# Altium schematic sheet STeaMi-FP8-Display_et_LED_statuts.SchDoc
size A3; DocumentNumber: 1; SheetNumber: 9; SheetTotal: 16
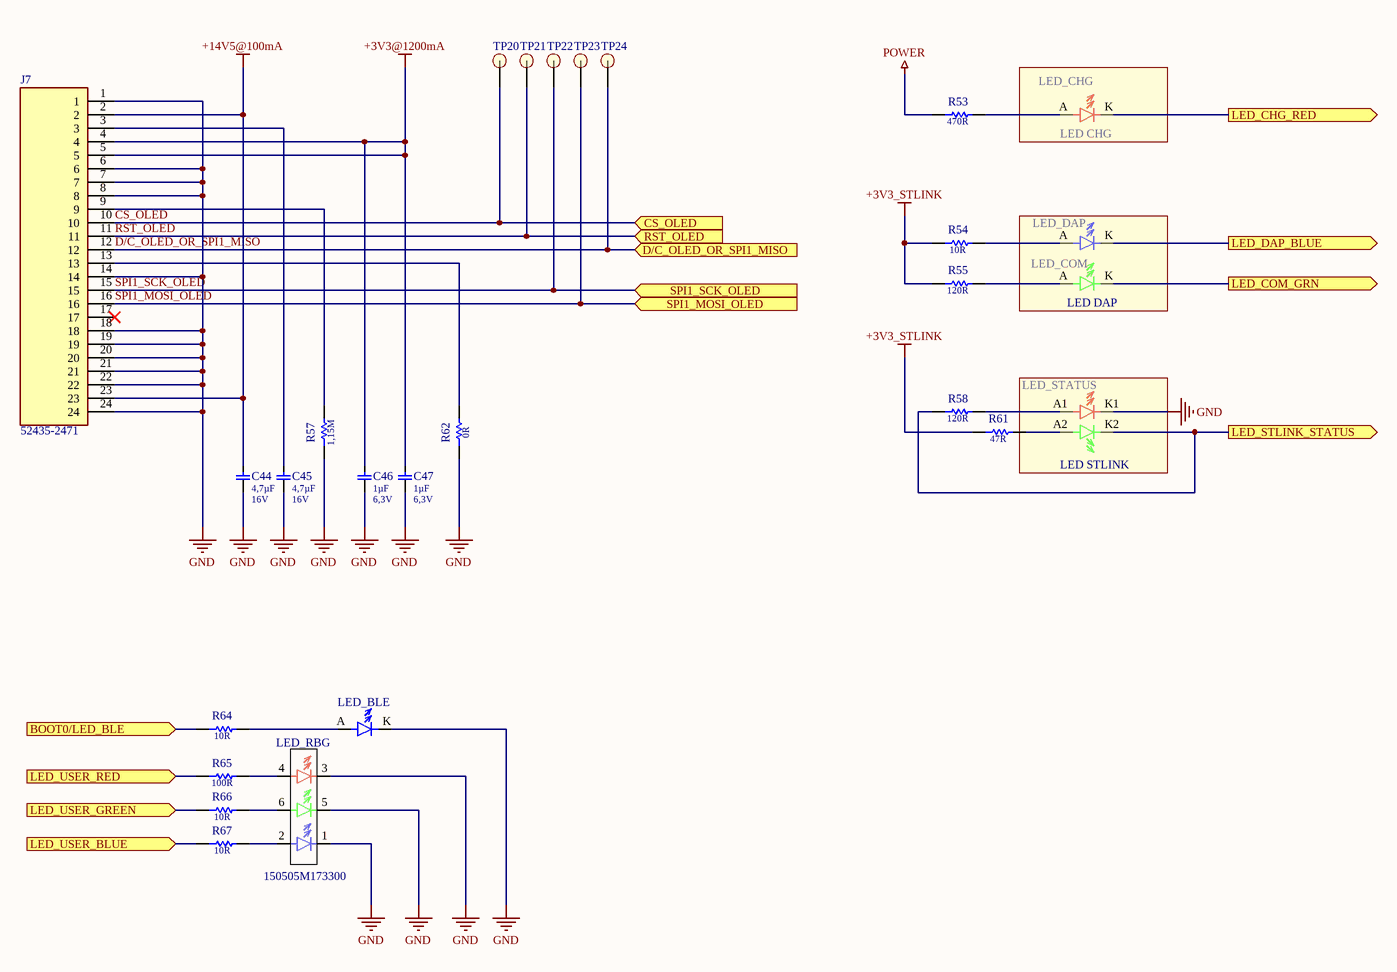
[diagram p0: STeaMi-FP8-Display_et_LED_statuts.SchDoc]

## Parts
C44  Capacitance: 4,7µF  Voltage: 16V  [0402-CAP]
C45  Capacitance: 4,7µF  Voltage: 16V  [0402-CAP]
C46  Capacitance: 1µF  Voltage: 6,3V  [0402-CAP]
C47  Capacitance: 1µF  Voltage: 6,3V  [0402-CAP]
J7  (no value)  [52435-2471]
LED_BLE  (no value)  [APTD1608LZGCK-B]
LED_CHG  (no value)  [APTD1608LZGCK]
LED_COM  (no value)  [APTD1608LZGCK]
LED_DAP  (no value)  [APTD1608LZGCK]
LED_RBG  (no value)  [150505M173300]
LED_STATUS  (no value)  [KPHBM2012QBDCGKC]
R53  Resistance: 470R  [RESC1005X40N_0402]
R54  Resistance: 10R  [RESC1005X40N_0402]
R55  Resistance: 120R  [RESC1005X40N_0402]
R57  Resistance: 1,15M  [RESC1005X40N_0402]
R58  Resistance: 120R  [RESC1005X40N_0402]
R61  Resistance: 47R  [RESC1005X40N_0402]
R62  Resistance: 0R  [RESC1005X40N_0402]
R64  Resistance: 10R  [RESC1005X40N_0402]
R65  Resistance: 100R  [RESC1005X40N_0402]
R66  Resistance: 10R  [RESC1005X40N_0402]
R67  Resistance: 10R  [RESC1005X40N_0402]
TP20  PAD  [Testpoint 1mm]  (value not drawn)  (no BOM)
TP21  PAD  [Testpoint 1mm]  (value not drawn)  (no BOM)
TP22  SCK1  [Testpoint 1mm]  (value not drawn)  (no BOM)
TP23  MOSI1  [Testpoint 1mm]  (value not drawn)  (no BOM)
TP24  PAD  [Testpoint 1mm]  (value not drawn)  (no BOM)

## Blocks framed on the sheet
LED CHG: LED_CHG
LED DAP: LED_COM LED_DAP
LED STLINK: LED_STATUS

## Ports
BOOT0/LED_BLE (in), CS_OLED (in), D/C_OLED_OR_SPI1_MISO (in), LED_CHG_RED (out), LED_COM_GRN (out), LED_DAP_BLUE (out), LED_STLINK_STATUS (out), LED_USER_BLUE (in), LED_USER_GREEN (in), LED_USER_RED (in), RST_OLED (in), SPI1_MOSI_OLED (in), SPI1_SCK_OLED (in)

## Nets
+3V3@1200mA: C46.2 C47.2 J7.4 J7.5
+3V3_STLINK: R54.1 R55.1 R61.1
+14V5@100mA: C44.2 J7.2 J7.23
GND: C44.1 C45.1 C46.1 C47.1 J7.1 J7.6 J7.7 J7.8 J7.14 J7.18 J7.19 J7.20 J7.21 J7.22 J7.24 LED_BLE.K LED_RBG.1 LED_RBG.3 LED_RBG.5 LED_STATUS.K1 R57.1 R62.1
POWER: R53.1
BOOT0/LED_BLE: R64.1 ; port BOOT0/LED_BLE
CS_OLED: J7.10 TP20.1 ; port CS_OLED
D/C_OLED_OR_SPI1_MISO: J7.12 TP24.1 ; port D/C_OLED_OR_SPI1_MISO
LED_CHG_RED: LED_CHG.K ; port LED_CHG_RED
LED_COM_GRN: LED_COM.K ; port LED_COM_GRN
LED_DAP_BLUE: LED_DAP.K ; port LED_DAP_BLUE
LED_STLINK_STATUS: LED_STATUS.K2 R58.1 ; port LED_STLINK_STATUS
LED_USER_BLUE: R67.1 ; port LED_USER_BLUE
LED_USER_GREEN: R66.1 ; port LED_USER_GREEN
LED_USER_RED: R65.1 ; port LED_USER_RED
RST_OLED: J7.11 TP21.1 ; port RST_OLED
SPI1_MOSI_OLED: J7.16 TP23.1 ; port SPI1_MOSI_OLED
SPI1_SCK_OLED: J7.15 TP22.1 ; port SPI1_SCK_OLED
NetC45_2: C45.2 J7.3
NetJ7_9: J7.9 R57.2
NetJ7_13: J7.13 R62.2
NetLED_BLE_A: LED_BLE.A R64.2
NetLED_CHG_A: LED_CHG.A R53.2
NetLED_COM_A: LED_COM.A R55.2
NetLED_DAP_A: LED_DAP.A R54.2
NetLED_RBG_2: LED_RBG.2 R67.2
NetLED_RBG_4: LED_RBG.4 R65.2
NetLED_RBG_6: LED_RBG.6 R66.2
NetLED_STATUS_A1: LED_STATUS.A1 R58.2
NetLED_STATUS_A2: LED_STATUS.A2 R61.2

Not connected (* = marked no-connect by the designer): J7 17*

## Notes on the sheet
- Le présent document est la propriété exclusive de SmartEmbed. Remis à titre confidentiel, il ne peut être communiqué
- IND
- DATE
- DESCRIPTION
- VISA
- à des tiers, ni utilisé ou reproduit qu'en stricte conformité d'autorisations expresses préalables.
- Etabli le:
- Verifié le:
- Validé le:
- Par:
- Page:
- /
- Pépinière CleanTech Domaine du Petit Arbois Avenue Louis Philibert BP 80058 13792 AIX-EN-PROVENCE CEDEX 3
- REFERENCE
- DESIGNATION

## Library data of the parts
C44 C45 = 4,7µF-20%-16V-X5R-0402: CAP CER 4,7µF 16V X5R 0402; Manufacturer: Kyocera AVX; Manufacturer Part Number: 0402YD475MAT2A; Populated: True; std Package: 0402; Tolerence: 0,2; Vérification: Non; Created by: EAG; Creation Date: 29/11/2021; Checked by: *; Part Number: 4,7µF-20%-16V-X5R-0402; Dielectric: X5R; Digikey: 478-10788-1-ND; Mouser: 581-0402YD475MAT2A; Switch possibility: True
C46 C47 = 1µF-10%-6,3V-X5R-0402: CAP CER 1µF 6,3V X5R 0402; Manufacturer: Taiyo Yuden; Manufacturer Part Number: JMK105BJ105KV-F; Populated: True; std Package: 0402; Tolerence: 0,1; Vérification: Non; Created by: EAG; Creation Date: 08/04/2021; Checked by: *; Part Number: 1µF-10%-6,3V-X5R-0402; Dielectric: X5R; Mouser: 963-JMK105BJ105KV-F; Switch possibility: True
J7 = 52435-2471: FFC/FPC connector 0,50 Pitch Slider Right angle TOP Contact; Manufacturer: Molex; Populated: False; RS: 52435-2471-TR250; Switch possibility: False; Vérification: Non; Checked by: *; Creation Date: 18/08/2021; Created by: EAG; Manufacturer Part Number: 52435-2471; Part Number: 52435-2471; Mouser: 538-52435-2471
LED_BLE LED_DAP = 150060BS75000: DEL standard - CMS WL-SMCW SMDMono TpVw Waterclr 0603 Blue; Manufacturer: WURTH; Populated: True; Switch possibility: False; Vérification: Non; Created by: EAG; Creation Date: 16/09/2021; Manufacturer Part Number: 150060BS75000; Part Number: 150060BS75000; Color: BLUE; Mouser: 710-150060BS75000
LED_CHG = 150060RS75000: DEL standard - CMS WL-SMCW SMDMono TpVw Waterclr 0603 RED; Manufacturer: WURTH; Populated: True; Switch possibility: False; Vérification: Non; Created by: EAG; Creation Date: 30/09/2021; Manufacturer Part Number: 150060RS75000; Part Number: 150060RS75000; Color: RED; Mouser: 710-150060RS75000
LED_COM = 150060VS75000: LED GREEN 2V 20mA 0603 SMD; Manufacturer: WURTH; Populated: True; F19: 0,13; Switch possibility: False; Vérification: Non; Created by: EAG; Creation Date: 12/03/2020; Manufacturer Part Number: 150060VS75000; Part Number: 150060VS75000; Color: GREEN RED; Mouser: 710-150060VS75000
LED_RBG = 150505M173300: DEL standard - CMS WL-SFTW SMD TOP SMD 5050 RGB; Manufacturer: WURTH; Populated: True; Switch possibility: False; Vérification: Non; Created by: EAG; Creation Date: 16/09/2021; Manufacturer Part Number: 150505M173300; Part Number: 150505M173300; Color: RGB; Digikey: 150505M173300; Mouser: 710-150505M173300
LED_STATUS = APHBM2012LSURKZGKC: LED BI Green Red 2mm x 1,25mm SMD; Manufacturer: Kingbright; Populated: True; Switch possibility: False; Vérification: Non; Created by: EAG; Creation Date: 30/09/2019; Manufacturer Part Number: APHBM2012LSURKZGKC; Part Number: APHBM2012LSURKZGKC; Color: GREEN RED; Mouser: 604-APHBM2012LSURKZG
R53 = 470R-5%-0,1W-0402: RES CMS 470R5%-0,1W-0402 ±200ppm/°C; Manufacturer: Panasonic; Manufacturer Part Number: ERJ-2GEJ471X; Populated: True; Power: 0,1; Nom vérificateur: Non; Prix: 0,09; std Package: 0402; Tolerence: 0,05; Created by: EAG; Creation Date: 02/12/2021; Part Number: 470R-5%-0,1W-0402; Mouser: 667-ERJ-2GEJ471X; Switch possibility: True
R54 R64 R66 R67 = 10R-1%-0,0625W-0402: RES CMS 10R1%-0,0625W-0402 ±200ppm/°C; Manufacturer: Yageo; Manufacturer Part Number: RC0402FR-1010RL; Populated: True; Power: 0,0625; Nom vérificateur: Non; Prix: 0,08; std Package: 0402; Tolerence: 0,01; Created by: EAG; Creation Date: 29/01/2021; Part Number: 10R-1%-0,0625W-0402; Mouser: 603-RC0402FR-1010RL; Switch possibility: True
R55 R58 = 120R-1%-0,0625W-0402: RES CMS 120R1%-0,0625W-0402 ±200ppm/°C; Manufacturer: Yageo; Manufacturer Part Number: AC0402FR-07120RL; Populated: True; Power: 0,0625; Nom vérificateur: Non; Prix: 0,09; std Package: 0402; Tolerence: 0,01; Created by: EAG; Creation Date: 02/12/2021; Part Number: 120R-1%-0,0625W-0402; Digikey: YAG3440CT-ND; Mouser: 603-AC0402FR-07120RL; Switch possibility: True
R57 = 1,15M-1%-0,1W-0402: RES CMS 1,15M1%-0,1W-0402 ±0ppm/°C; Manufacturer: KOA Speer; Manufacturer Part Number: RK73H1ETTP1154F; Populated: True; Power: 0,1; Nom vérificateur: Non; std Package: 0402; Tolerence: 0,01; Created by: EAG; Creation Date: 29/01/2021; Part Number: 1,15M-1%-0,1W-0402; Digikey: 2019-RK73H1ETTP1154FCT-ND; Mouser: 660-RK73H1ETTP1154F; Prix: 0,1; Switch possibility: True
R61 = 47R-1%-0,0625W-0402: RES CMS 47R1%-0,0625W-0402 ±100ppm/°C; Manufacturer: Yageo; Manufacturer Part Number: RC0402FR-0747RL; Populated: True; Power: 0,0625; Nom vérificateur: Non; Prix: 0,09; RS: 198-7801; std Package: 0402; Tolerence: 0,01; Created by: EAG; Creation Date: 02/12/2021; Part Number: 47R-1%-0,0625W-0402; Digikey: 311-47.0LRCT-ND; Mouser: 603-RC0402FR-0747RL; Switch possibility: True
R62 = 0R-5%-0,0625W-0402: RES CMS 0R5%-0,0625W-0402; Manufacturer: Yageo; Manufacturer Part Number: RC0402JR-100RL; Populated: True; Power: 0,0625; Nom vérificateur: Non; Prix: 0,09; std Package: 0402; Tolerence: 0,05; Created by: EAG; Creation Date: 02/12/2021; Part Number: 0R-5%-0,0625W-0402; Mouser: 603-RC0402JR-100RL; Switch possibility: True
R65 = 100R-5%-0,0625W-0402: RES CMS 100R5%-0,0625W-0402 ±100ppm/°C; Manufacturer: Yageo; Manufacturer Part Number: RC0402JR-07100RL; Populated: True; Power: 0,0625; Nom vérificateur: Non; Prix: 0,09; std Package: 0402; Tolerence: 0,05; Created by: EAG; Creation Date: 02/12/2021; Part Number: 100R-5%-0,0625W-0402; Digikey: 311-100JRCT-ND; Farnell: 9232648; Switch possibility: True
TP20-TP24 = TESTPOINTPAD: Manufacturer: Smartembed; Switch possibility: False; Vérification: Non; Package: PAD_TEST; Part Number: TESTPOINTPAD; Created by: EAG; Creation Date: 11/03/2020; Digikey: -; Farnell: -; Manufacturer Part Number: TESTPOINT; Mouser: -; RS: -